# Altium project HDMI_TO_MIPI.PrjPcb
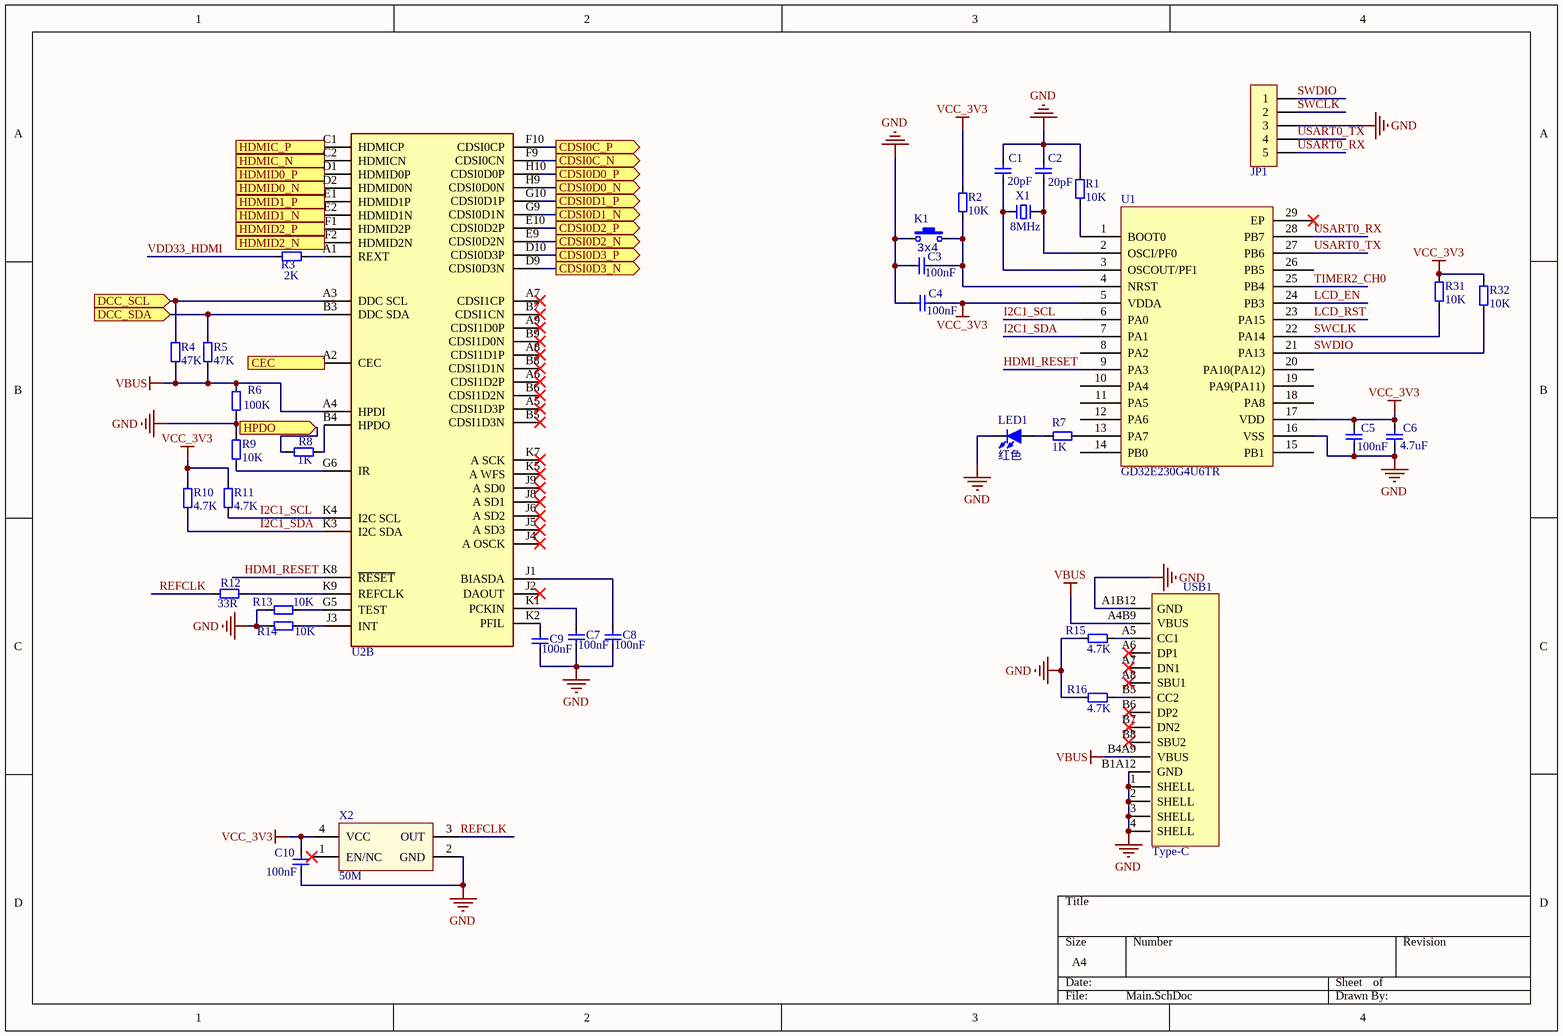
[diagram p0: Main.SchDoc]
3 sheets, 91 parts. Net scope: global (net labels, ports and power ports of the same name join across sheets).
Board file: HDMI_TO_MIPI.PcbDoc
Sheets:
  Main.SchDoc
  Power.SchDoc
  Connect.SchDoc

## Sheet Main.SchDoc
size A4; SheetNumber: 1; SheetTotal: 3

### Parts
C1  20pF  [C0402_L]
C2  20pF  [C0402_L]
C3  100nF  [C0402_L]
C4  100nF  [C0402_L]
C5  100nF  [C0402_L]
C6  4.7uF  [C0402_L]
C7  100nF  [C0402_L]
C8  100nF  [C0402_L]
C9  100nF  [C0402_L]
C10  100nF  [C0402_L]
JP1  HDR-1X5  [Test-2.54-5P]  (value not drawn)
K1  value 3x4  [ButtonTACT_3x4x2_180H]
LED1  红色  [LED0402]
R1  10K  [R0402_L]
R2  10K  [R0402_L]
R3  2K  [R0402_L]
R4  47K  [R0402_L]
R5  47K  [R0402_L]
R6  100K  [R0402_L]
R7  1K  [R0402_L]
R8  1K  [R0402_L]
R9  10K  [R0402_L]
R10  4.7K  [R0402_L]
R11  4.7K  [R0402_L]
R12  33R  [R0402_L]
R13  10K  [R0402_L]
R14  10K  [R0402_L]
R15  4.7K  [R0402_L]
R16  4.7K  [R0402_L]
R31  10K  [R0402_L]
R32  10K  [R0402_L]
U1  GD32E230G4U6TR  [GD32E230G4U6TR]
U2  TC358870XBG  [TC358870XBG]  (value not drawn)  (part B of 2)
USB1  Type-C  [Type-C 16P]
X1  8MHz  [OSC 5032-8M]
X2  50M  [OSC 3225-4P]

### Ports
CDSI0C_N (out), CDSI0C_P (out), CDSI0D0_N (out), CDSI0D0_P (out), CDSI0D1_N (out), CDSI0D1_P (out), CDSI0D2_N (out), CDSI0D2_P (out), CDSI0D3_N (out), CDSI0D3_P (out), CEC (in), DCC_SCL (in), DCC_SDA (in), HDMIC_N (in), HDMIC_P (in), HDMID0_N (in), HDMID0_P (in), HDMID1_N (in), HDMID1_P (in), HDMID2_N (in), HDMID2_P (in), HPDO (in)

### Nets
GND: C1.2 C2.2 C3.2 C4.2 C5.2 C6.2 C7.2 C8.1 C9.1 C10.1 JP1.3 K1.1 LED1.2(K) R1.1 R6.2 R9.2 R13.2 R14.2 R15.2 R16.2 U1.16(VSS) USB1.1(SHELL) USB1.2(SHELL) USB1.3(SHELL) USB1.4(SHELL) USB1.A1B12(GND) USB1.B1A12(GND) X2.2(GND)
VBUS: R4.1 R5.1 R6.1 U2.A4(HPDI) USB1.A4B9(VBUS) USB1.B4A9(VBUS)
VCC_3V3: C4.1 C5.1 C6.1 C10.2 R2.1 R10.1 R11.1 R31.1 R32.1 U1.5(VDDA) U1.17(VDD) X2.4(VCC)
CDSI0C_N: U2.F9(CDSI0CN) ; port CDSI0C_N
CDSI0C_P: U2.F10(CDSI0CP) ; port CDSI0C_P
CDSI0D0_N: U2.H9(CDSI0D0N) ; port CDSI0D0_N
CDSI0D0_P: U2.H10(CDSI0D0P) ; port CDSI0D0_P
CDSI0D1_N: U2.G9(CDSI0D1N) ; port CDSI0D1_N
CDSI0D1_P: U2.G10(CDSI0D1P) ; port CDSI0D1_P
CDSI0D2_N: U2.E9(CDSI0D2N) ; port CDSI0D2_N
CDSI0D2_P: U2.E10(CDSI0D2P) ; port CDSI0D2_P
CDSI0D3_N: U2.D9(CDSI0D3N) ; port CDSI0D3_N
CDSI0D3_P: U2.D10(CDSI0D3P) ; port CDSI0D3_P
HDMI_RESET: U1.9(PA3) U2.K8(~{RESET})
HDMIC_N: U2.C2(HDMICN) ; port HDMIC_N
HDMIC_P: U2.C1(HDMICP) ; port HDMIC_P
HDMID0_N: U2.D2(HDMID0N) ; port HDMID0_N
HDMID0_P: U2.D1(HDMID0P) ; port HDMID0_P
HDMID1_N: U2.E2(HDMID1N) ; port HDMID1_N
HDMID1_P: U2.E1(HDMID1P) ; port HDMID1_P
HDMID2_N: U2.F2(HDMID2N) ; port HDMID2_N
HDMID2_P: U2.F1(HDMID2P) ; port HDMID2_P
I2C1_SCL: R11.2 U1.6(PA0) U2.K4(I2C_SCL)
I2C1_SDA: R10.2 U1.7(PA1) U2.K3(I2C_SDA)
LCD_EN: U1.24(PB3)
LCD_RST: U1.23(PA15)
REFCLK: R12.2 X2.3(OUT)
SWCLK: JP1.2 R31.2 U1.22(PA14)
SWDIO: JP1.1 R32.2 U1.21(PA13)
TIMER2_CH0: U1.25(PB4)
USART0_RX: JP1.5 U1.28(PB7)
USART0_TX: JP1.4 U1.27(PB6)
VDD33_HDMI: R3.2
NetC1_1: C1.1 U1.3(OSCOUT/PF1) X1.1
NetC2_1: C2.1 U1.2(OSCI/PF0) X1.2
NetC3_1: C3.1 K1.2 R2.2 U1.4(NRST)
NetC7_1: C7.1 U2.K1(PCKIN)
NetC8_2: C8.2 U2.J1(BIASDA)
NetC9_2: C9.2 U2.K2(PFIL)
NetHDMI1_13: U2.A2(CEC) ; port CEC
NetHDMI1_15: R4.2 U2.A3(DDC_SCL) ; port DCC_SCL
NetHDMI1_16: R5.2 U2.B3(DDC_SDA) ; port DCC_SDA
NetHDMI1_19: R8.2 ; port HPDO
NetLED1_1: LED1.1(A) R7.1
NetR1_2: R1.2 U1.1(BOOT0)
NetR3_1: R3.1 U2.A1(REXT)
NetR7_2: R7.2 U1.13(PA7)
NetR8_1: R8.1 U2.B4(HPDO)
NetR9_1: R9.1 U2.G6(IR)
NetR12_1: R12.1 U2.K9(REFCLK)
NetR13_1: R13.1 U2.G5(TEST)
NetR14_1: R14.1 U2.J3(INT)
NetR15_1: R15.1 USB1.A5(CC1)
NetR16_1: R16.1 USB1.B5(CC2)

Not connected (* = marked no-connect by the designer): U1 8(PA2) 10(PA4) 11(PA5) 12(PA6) 14(PB0) 15(PB1) 18(PA8) 19(PA9(PA11)) 20(PA10(PA12)) 26(PB5) 29(EP)*; U2 A5(CDSI1D3P)* A6(CDSI1D2P)* A7(CDSI1CP)* A8(CDSI1D1P)* A9(CDSI1D0P)* B5(CDSI1D3N)* B6(CDSI1D2N)* B7(CDSI1CN)* B8(CDSI1D1N)* B9(CDSI1D0N)* J2(DAOUT)* J4(A_OSCK)* J5(A_SD3)* J6(A_SD2)* J8(A_SD1)* J9(A_SD0)* K5(A_WFS)* K7(A_SCK)*; USB1 A6(DP1)* A7(DN1)* A8(SBU1)* B6(DP2)* B7(DN2)* B8(SBU2)*; X2 1(EN/NC)*

### Library data of the parts
C1-C10 = C: 贴片电容; BOM名称: 无极性贴片电容; 联系卖家，免费查找封装: 唯一出售店铺网址https://shop463601444.taobao.com
JP1 = Header 5: 5P接插件; 版权归属: 源创客; BOM名称: 5P接插件; 学习资源: www.ooocke.com
K1 = ButtonTACT_3x4x2_180: Button
LED1 = LED-SMD: 贴片LED; 封装库来自淘宝卖家 ID：黄晶宝石: 其他店铺购入均为假冒，请立即申请退款，本店奖励现金5~20元; BOM名称: 贴片LED
R1-R16 R31 R32 = R: 贴片电阻; 联系卖家，免费查找封装: 唯一出售店铺网址https://shop463601444.taobao.com; 封装库来自淘宝卖家ID：黄晶宝石: 其他店铺购入均为盗版假冒封装库，请立即申请退款; BOM名称: 贴片电阻
X1 = XTAL-2P: 2脚无源脚晶振; 联系卖家，免费查找封装: 唯一出售店铺网址https://shop463601444.taobao.com; BOM名称: 2脚无源脚晶振
X2 = XTAL-ACT-4P: 4脚有源晶振; 联系卖家，免费查找封装: 唯一出售店铺网址https://shop463601444.taobao.com; BOM名称: 4脚有源晶振

## Sheet Power.SchDoc
size A4; SheetNumber: 2; SheetTotal: 3
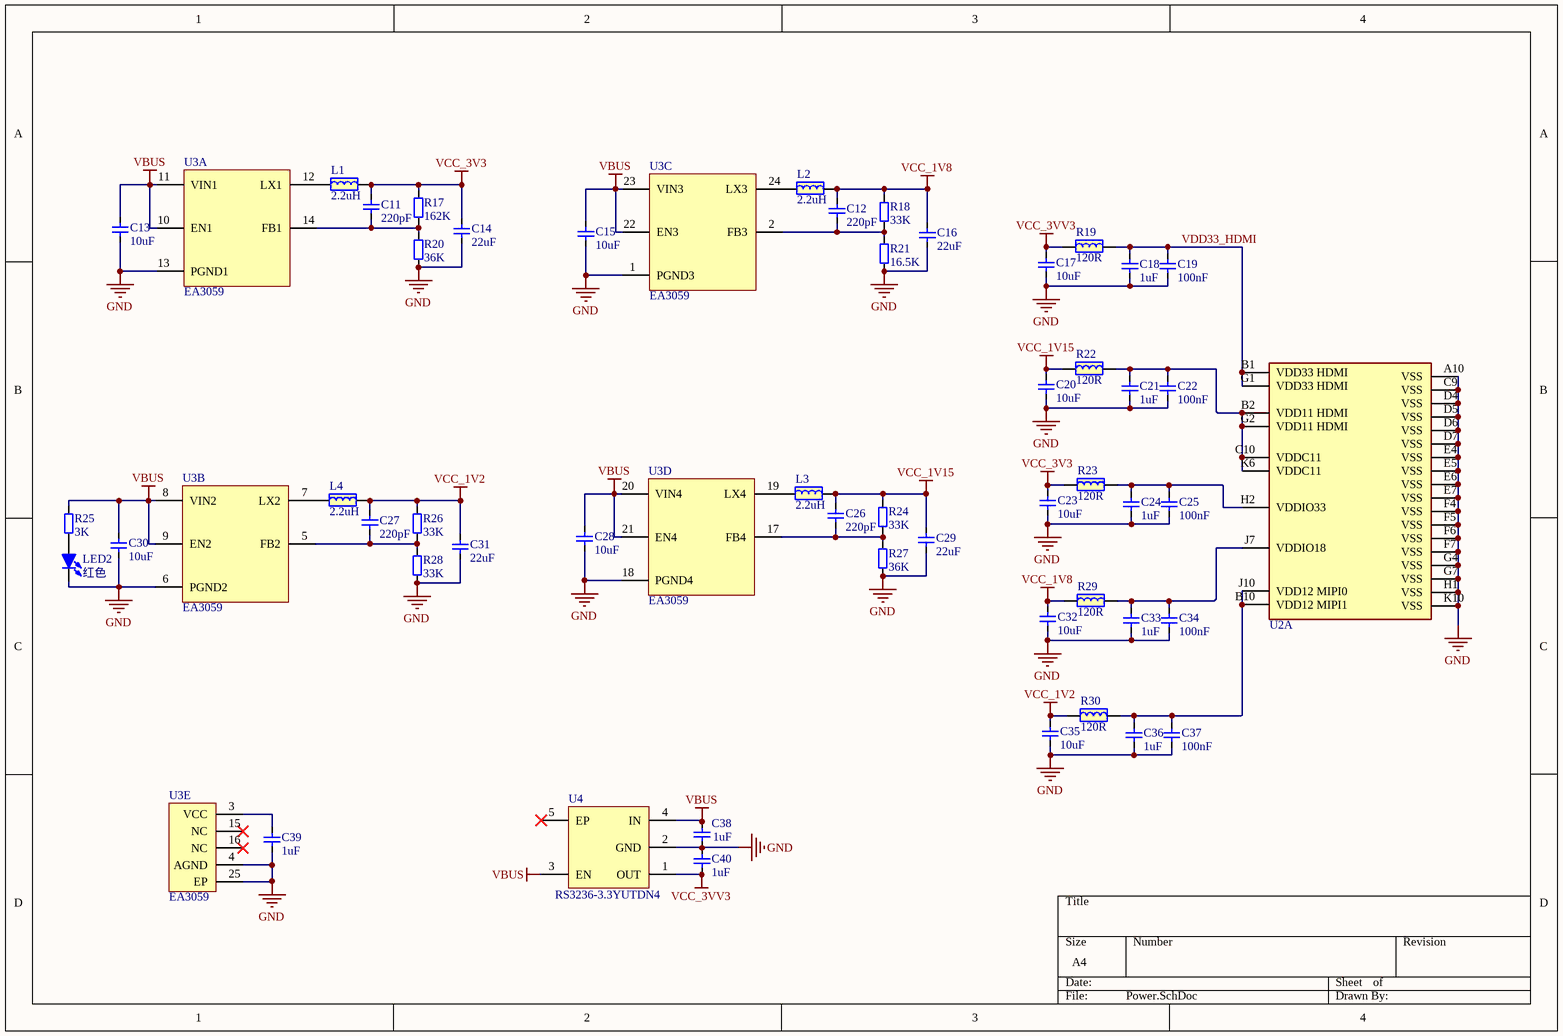
[diagram p1: Power.SchDoc]

### Parts
C11  220pF  [C0402_L]
C12  220pF  [C0402_L]
C13  10uF  [C0402_L]
C14  22uF  [C0402_L]
C15  10uF  [C0402_L]
C16  22uF  [C0402_L]
C17  10uF  [C0402_L]
C18  1uF  [C0402_L]
C19  100nF  [C0402_L]
C20  10uF  [C0402_L]
C21  1uF  [C0402_L]
C22  100nF  [C0402_L]
C23  10uF  [C0402_L]
C24  1uF  [C0402_L]
C25  100nF  [C0402_L]
C26  220pF  [C0402_L]
C27  220pF  [C0402_L]
C28  10uF  [C0402_L]
C29  22uF  [C0402_L]
C30  10uF  [C0402_L]
C31  22uF  [C0402_L]
C32  10uF  [C0402_L]
C33  1uF  [C0402_L]
C34  100nF  [C0402_L]
C35  10uF  [C0402_L]
C36  1uF  [C0402_L]
C37  100nF  [C0402_L]
C38  1uF  [C0402_L]
C39  1uF  [C0402_L]
C40  1uF  [C0402_L]
L1  2.2uH  [L0603]
L2  2.2uH  [L0603]
L3  2.2uH  [L0603]
L4  2.2uH  [L0603]
LED2  红色  [LED0402]
R17  162K  [R0402_L]
R18  33K  [R0402_L]
R19  120R  [L0402]
R20  36K  [R0402_L]
R21  16.5K  [R0402_L]
R22  120R  [L0402]
R23  120R  [L0402]
R24  33K  [R0402_L]
R25  3K  [R0402_L]
R26  33K  [R0402_L]
R27  36K  [R0402_L]
R28  33K  [R0402_L]
R29  120R  [L0402]
R30  120R  [L0402]
U2  TC358870XBG  [TC358870XBG]  (value not drawn)  (part A of 2)
U3  EA3059  [EA3059]  (parts A,B,C,D,E of 5)
U4  RS3236-3.3YUTDN4  [RS3236-3.3YUTDN4]

### Nets
GND: C13.1 C14.1 C15.1 C16.1 C17.1 C18.1 C19.1 C20.1 C21.1 C22.1 C23.1 C24.1 C25.1 C28.1 C29.1 C30.1 C31.1 C32.1 C33.1 C34.1 C35.1 C36.1 C37.1 C38.1 C39.1 C40.2 LED2.2(K) R20.1 R21.1 R27.1 R28.1 U2.A10(VSS) U2.C9(VSS) U2.D4(VSS) U2.D5(VSS) U2.D6(VSS) U2.D7(VSS) U2.E4(VSS) U2.E5(VSS) U2.E6(VSS) U2.E7(VSS) U2.F4(VSS) U2.F5(VSS) U2.F6(VSS) U2.F7(VSS) U2.G4(VSS) U2.G7(VSS) U2.H1(VSS) U2.K10(VSS) U3.1(PGND3) U3.4(AGND) U3.6(PGND2) U3.13(PGND1) U3.18(PGND4) U3.25(EP) U4.2(GND)
VBUS: C13.2 C15.2 C28.2 C30.2 C38.2 R25.2 U3.8(VIN2) U3.9(EN2) U3.10(EN1) U3.11(VIN1) U3.20(VIN4) U3.21(EN4) U3.22(EN3) U3.23(VIN3) U4.3(EN) U4.4(IN)
VCC_1V2: C27.2 C31.2 C35.2 L4.2 R26.2 R30.1
VCC_1V8: C12.2 C16.2 C32.2 L2.2 R18.2 R29.1
VCC_1V15: C20.2 C26.2 C29.2 L3.2 R22.1 R24.2
VCC_3V3: C11.2 C14.2 C23.2 L1.2 R17.2 R23.1
VCC_3VV3: C17.2 C40.1 R19.1 U4.1(OUT)
VDD33_HDMI: C18.2 C19.2 R19.2 U2.B1(VDD33_HDMI) U2.G1(VDD33_HDMI)
NetC11_1: C11.1 R17.1 R20.2 U3.14(FB1)
NetC12_1: C12.1 R18.1 R21.2 U3.2(FB3)
NetC21_2: C21.2 C22.2 R22.2 U2.B2(VDD11_HDMI) U2.C10(VDDC11) U2.G2(VDD11_HDMI) U2.K6(VDDC11)
NetC24_2: C24.2 C25.2 R23.2 U2.H2(VDDIO33)
NetC26_1: C26.1 R24.1 R27.2 U3.17(FB4)
NetC27_1: C27.1 R26.1 R28.2 U3.5(FB2)
NetC33_2: C33.2 C34.2 R29.2 U2.J7(VDDIO18)
NetC36_2: C36.2 C37.2 R30.2 U2.B10(VDD12_MIPI1) U2.J10(VDD12_MIPI0)
NetC39_2: C39.2 U3.3(VCC)
NetL1_1: L1.1 U3.12(LX1)
NetL2_1: L2.1 U3.24(LX3)
NetL3_1: L3.1 U3.19(LX4)
NetL4_1: L4.1 U3.7(LX2)
NetLED2_1: LED2.1(A) R25.1

Not connected (* = marked no-connect by the designer): U3 15(NC)* 16(NC)*; U4 5(EP)*

### Library data of the parts
C11-C40 = C: as C1 on sheet Main
L1-L4 R19 R22 R23 R29 R30 = L-FB: 磁珠
LED2 = LED-SMD: as LED1 on sheet Main; BOM名称: 贴片LED
R17 R18 R20 R21 R24-R28 = R: as R1 on sheet Main; BOM名称: 贴片电阻
U3 = EA3059: 4CH_BUCK

## Sheet Connect.SchDoc
size A4; SheetNumber: 3; SheetTotal: 3
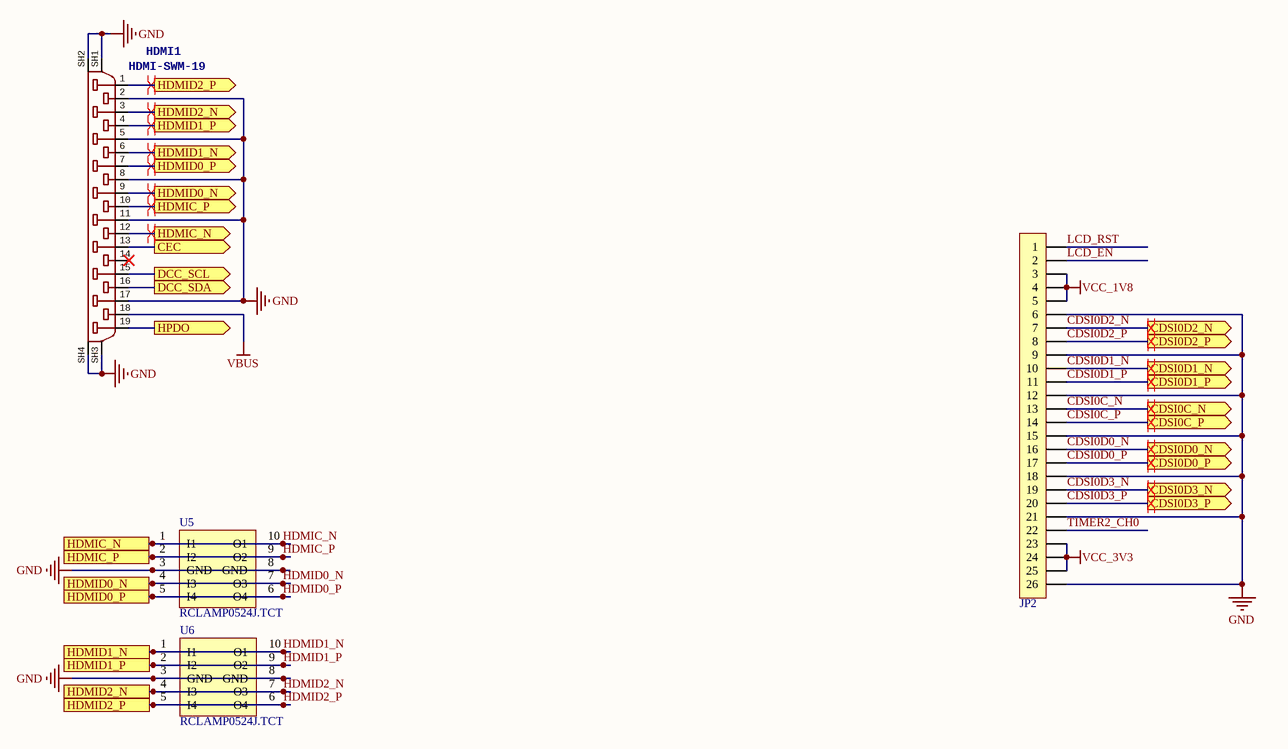
[diagram p2: Connect.SchDoc]

### Parts
HDMI1  HDMI-SWM-19  [HDMI-SWM-19]
JP2  FPC1.0-26P  [FPC0.5 2H-WS-26P]  (value not drawn)
U5  RCLAMP0524J.TCT  [RCLAMP0524J.TCT]
U6  RCLAMP0524J.TCT  [RCLAMP0524J.TCT]

### Ports
CDSI0C_N (out), CDSI0C_P (out), CDSI0D0_N (out), CDSI0D0_P (out), CDSI0D1_N (out), CDSI0D1_P (out), CDSI0D2_N (out), CDSI0D2_P (out), CDSI0D3_N (out), CDSI0D3_P (out), CEC (out), DCC_SCL (out), DCC_SDA (out), HDMIC_N, HDMIC_N (out), HDMIC_P, HDMIC_P (out), HDMID0_N, HDMID0_N (out), HDMID0_P, HDMID0_P (out), HDMID1_N, HDMID1_N (out), HDMID1_P, HDMID1_P (out), HDMID2_N, HDMID2_N (out), HDMID2_P, HDMID2_P (out), HPDO (out)

### Nets
GND: HDMI1.2 HDMI1.5 HDMI1.8 HDMI1.11 HDMI1.17 HDMI1.SH1 HDMI1.SH2 HDMI1.SH3 HDMI1.SH4 JP2.6 JP2.9 JP2.12 JP2.15 JP2.18 JP2.21 JP2.26 U5.3(GND) U5.8(GND) U6.3(GND) U6.8(GND)
VBUS: HDMI1.18
VCC_1V8: JP2.3 JP2.4 JP2.5
VCC_3V3: JP2.23 JP2.24 JP2.25
CDSI0C_N: JP2.13 ; port CDSI0C_N
CDSI0C_P: JP2.14 ; port CDSI0C_P
CDSI0D0_N: JP2.16 ; port CDSI0D0_N
CDSI0D0_P: JP2.17 ; port CDSI0D0_P
CDSI0D1_N: JP2.10 ; port CDSI0D1_N
CDSI0D1_P: JP2.11 ; port CDSI0D1_P
CDSI0D2_N: JP2.7 ; port CDSI0D2_N
CDSI0D2_P: JP2.8 ; port CDSI0D2_P
CDSI0D3_N: JP2.19 ; port CDSI0D3_N
CDSI0D3_P: JP2.20 ; port CDSI0D3_P
HDMIC_N: HDMI1.12 U5.1(I1) U5.10(O1) ; port HDMIC_N
HDMIC_P: HDMI1.10 U5.2(I2) U5.9(O2) ; port HDMIC_P
HDMID0_N: HDMI1.9 U5.4(I3) U5.7(O3) ; port HDMID0_N
HDMID0_P: HDMI1.7 U5.5(I4) U5.6(O4) ; port HDMID0_P
HDMID1_N: HDMI1.6 U6.1(I1) U6.10(O1) ; port HDMID1_N
HDMID1_P: HDMI1.4 U6.2(I2) U6.9(O2) ; port HDMID1_P
HDMID2_N: HDMI1.3 U6.4(I3) U6.7(O3) ; port HDMID2_N
HDMID2_P: HDMI1.1 U6.5(I4) U6.6(O4) ; port HDMID2_P
LCD_EN: JP2.2
LCD_RST: JP2.1
TIMER2_CH0: JP2.22
NetHDMI1_13: HDMI1.13 ; port CEC
NetHDMI1_15: HDMI1.15 ; port DCC_SCL
NetHDMI1_16: HDMI1.16 ; port DCC_SDA
NetHDMI1_19: HDMI1.19 ; port HPDO

Not connected (* = marked no-connect by the designer): HDMI1 14*

### Layout directives
differential pair: CDSI0C_N, CDSI0C_P, CDSI0D0_N, CDSI0D0_P, CDSI0D1_N, CDSI0D1_P, CDSI0D2_N, CDSI0D2_P, CDSI0D3_N, CDSI0D3_P, HDMIC_N, HDMIC_P, HDMID0_N, HDMID0_P, HDMID1_N, HDMID1_P, HDMID2_N, HDMID2_P

### Library data of the parts
HDMI1 = HDMI-MC34931HDMI-SWM-19_1
JP2 = FPC-26P: FPC连接器; 版权归属: 源创客; BOM名称: FPC连接器; 学习资源: www.ooocke.com
U5 U6 = RCLAMP0524J.TCT: HDMI ESD保护器件 C35368

## Nets that join several sheets
GND: Main (28 pins), Power (56 pins), Connect (20 pins)
VBUS: Main (6 pins), Power (16 pins), Connect (HDMI1.18)
VCC_1V8: Power (6 pins), Connect (JP2.3 JP2.4 JP2.5)
VCC_3V3: Main (12 pins), Power (6 pins), Connect (JP2.23 JP2.24 JP2.25)
CDSI0C_N: Main (U2.F9), Connect (JP2.13)
CDSI0C_P: Main (U2.F10), Connect (JP2.14)
CDSI0D0_N: Main (U2.H9), Connect (JP2.16)
CDSI0D0_P: Main (U2.H10), Connect (JP2.17)
CDSI0D1_N: Main (U2.G9), Connect (JP2.10)
CDSI0D1_P: Main (U2.G10), Connect (JP2.11)
CDSI0D2_N: Main (U2.E9), Connect (JP2.7)
CDSI0D2_P: Main (U2.E10), Connect (JP2.8)
CDSI0D3_N: Main (U2.D9), Connect (JP2.19)
CDSI0D3_P: Main (U2.D10), Connect (JP2.20)
HDMIC_N: Main (U2.C2), Connect (HDMI1.12 U5.1 U5.10)
HDMIC_P: Main (U2.C1), Connect (HDMI1.10 U5.2 U5.9)
HDMID0_N: Main (U2.D2), Connect (HDMI1.9 U5.4 U5.7)
HDMID0_P: Main (U2.D1), Connect (HDMI1.7 U5.5 U5.6)
HDMID1_N: Main (U2.E2), Connect (HDMI1.6 U6.1 U6.10)
HDMID1_P: Main (U2.E1), Connect (HDMI1.4 U6.2 U6.9)
HDMID2_N: Main (U2.F2), Connect (HDMI1.3 U6.4 U6.7)
HDMID2_P: Main (U2.F1), Connect (HDMI1.1 U6.5 U6.6)
LCD_EN: Main (U1.24), Connect (JP2.2)
LCD_RST: Main (U1.23), Connect (JP2.1)
NetHDMI1_13: Main (U2.A2), Connect (HDMI1.13)
NetHDMI1_15: Main (R4.2 U2.A3), Connect (HDMI1.15)
NetHDMI1_16: Main (R5.2 U2.B3), Connect (HDMI1.16)
NetHDMI1_19: Main (R8.2), Connect (HDMI1.19)
TIMER2_CH0: Main (U1.25), Connect (JP2.22)
VDD33_HDMI: Main (R3.2), Power (5 pins)